# EAGLE design AD7173 (EAGLE 7.5.0)
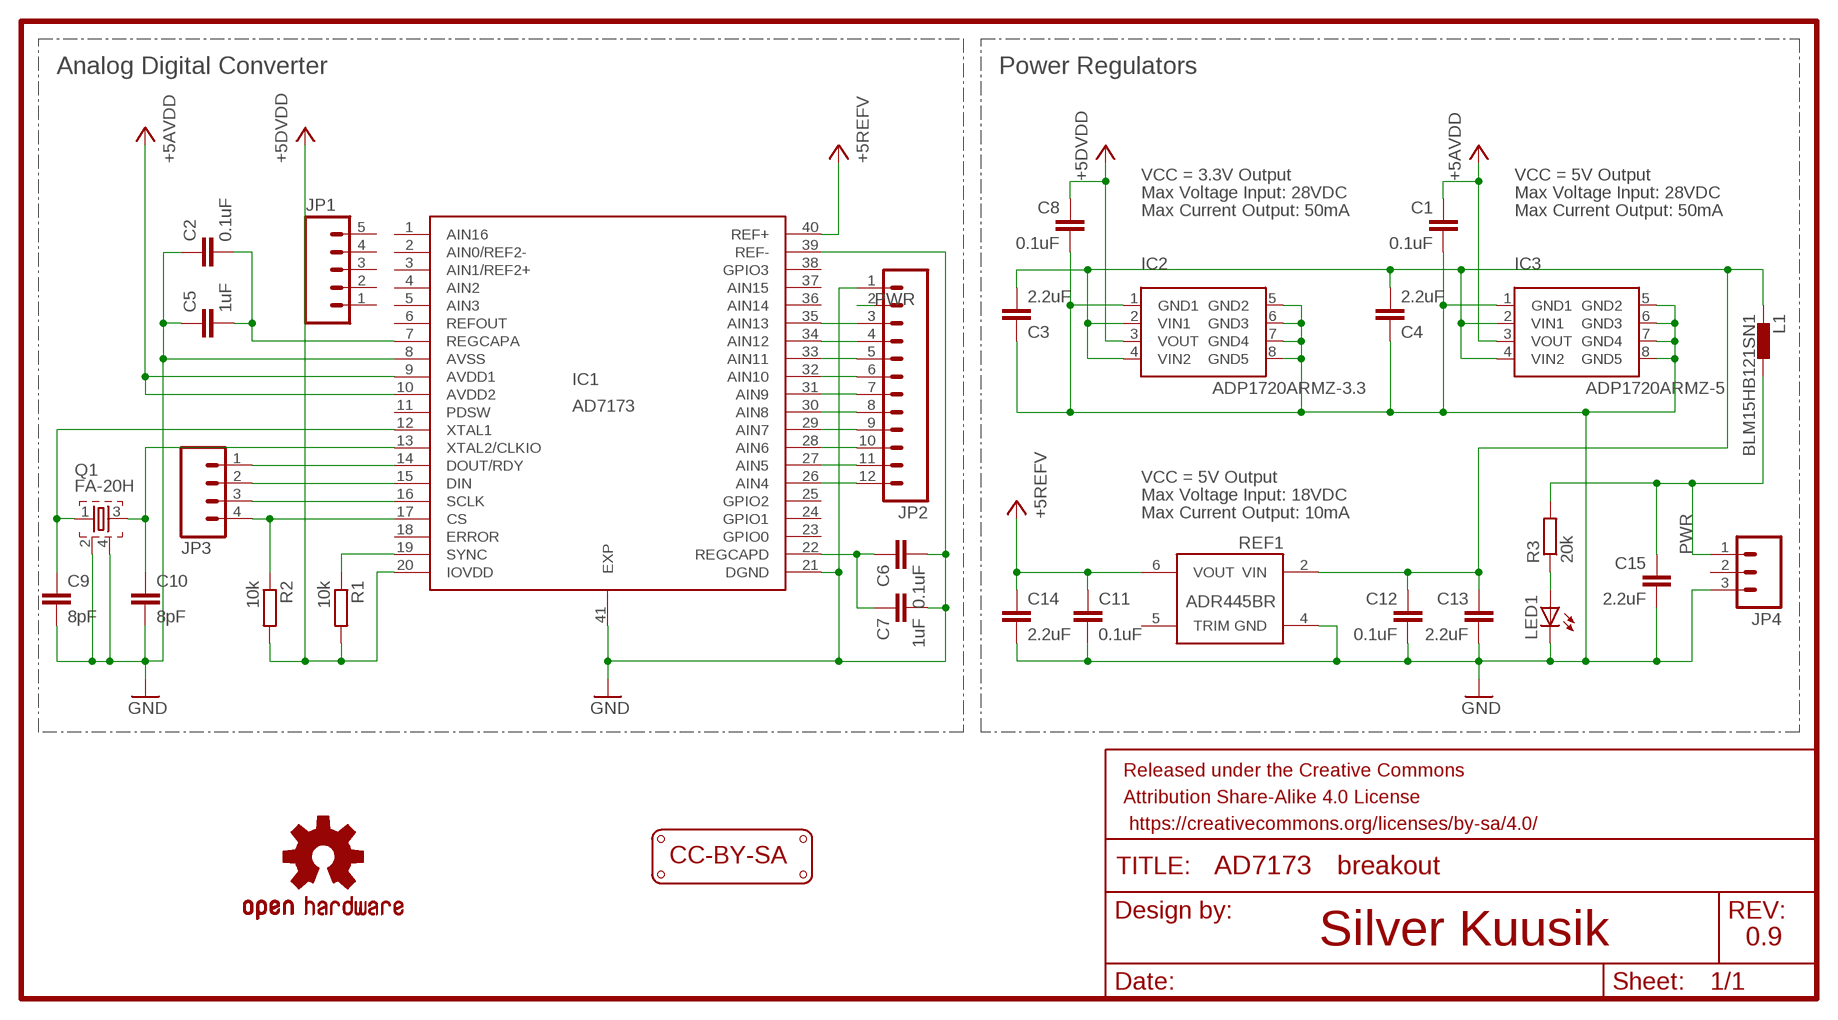
[diagram p0: schematic, sheet 1]

## Parts
C1  0.1uF  C-EUC0402  [C0402]
C2  0.1uF  C-EUC0402  [C0402]
C3  2.2uF  C-EUC0402  [C0402]
C4  2.2uF  C-EUC0402  [C0402]
C5  1uF  C-EUC0402  [C0402]
C6  0.1uF  C-EUC0402  [C0402]
C7  1uF  C-EUC0402  [C0402]
C8  0.1uF  C-EUC0402  [C0402]
C9  8pF  C-EUC0402  [C0402]
C10  8pF  C-EUC0402  [C0402]
C11  0.1uF  C-EUC0402  [C0402]
C12  0.1uF  C-EUC0402  [C0402]
C13  2.2uF  C-EUC0402  [C0402]
C14  2.2uF  C-EUC0402  [C0402]
C15  2.2uF  C-EUC0402  [C0402]
FRAME1  FRAME-LETTER  [CREATIVE_COMMONS]
IC1  AD7173  [LFCSP_WQ6X6MM]
IC2  ADP1720ARMZ-3.3  POWER  [MSOP08]
IC3  ADP1720ARMZ-5  POWER  [MSOP08]
JP1  M05PTH  [1X05]
JP2  M12PTH  [1X12]
JP3  M04PTH  [1X04]
JP4  M03PTH  [1X03]
L1  BLM15HB121SN1  [0402]
LED1  LEDCHIP-LED0603  [CHIP-LED0603]
LOGO1  OSHW-LOGOS  [OSHW-LOGO-S]
LOGO2  LOGO_CC-BY-SA  [LOGO_CC-BY-SA]
Q1  FA-20H  [FA-20H]
R1  10k  R-EU_R0402  [R0402]
R2  10k  R-EU_R0402  [R0402]
R3  20k  R-EU_R0402  [R0402]
REF1  ADR445BR  [SO8]

## Nets
+3V3: C8.1 IC1.20(IOVDD) IC2.3(VOUT) R1.2 R2.2 ; supply symbol labelled +5DVDD
+5V: C1.1 IC1.9(AVDD1) IC1.10(AVDD2) IC3.3(VOUT) ; supply symbol labelled +5AVDD
GND: C1.2 C2.1 C3.1 C4.1 C5.1 C6.2 C7.2 C8.2 C9.2 C10.2 C11.2 C12.2 C13.2 C14.2 C15.2 IC1.8(AVSS) IC1.21(DGND) IC1.39(REF-) IC1.41(EXP) IC2.1(GND1) IC2.5(GND2) IC2.6(GND3) IC2.7(GND4) IC2.8(GND5) IC3.1(GND1) IC3.5(GND2) IC3.6(GND3) IC3.7(GND4) IC3.8(GND5) JP2.1 JP4.3 LED1.C Q1.2 Q1.4 REF1.4(GND)
N$1: IC1.16(SCLK) JP3.3
N$3: IC1.17(CS) JP3.4 R2.1
N$4: C6.1 C7.1 IC1.22(REGCAPD)
N$5: IC1.34(AIN12) JP2.4
N$6: C2.2 C5.2 IC1.7(REGCAPA)
N$7: IC1.35(AIN13) JP2.3
N$10: IC1.33(AIN11) JP2.5
N$11: IC1.32(AIN10) JP2.6
N$12: IC1.31(AIN9) JP2.7
N$13: IC1.30(AIN8) JP2.8
N$14: IC1.29(AIN7) JP2.9
N$15: IC1.15(DIN) JP3.2
N$16: IC1.27(AIN5) JP2.11
N$17: IC1.26(AIN4) JP2.12
N$22: C10.1 IC1.13(XTAL2/CLKIO) Q1.3
N$23: IC1.28(AIN6) JP2.10
N$24: IC1.14(DOUT/RDY) JP3.1
N$27: C9.1 IC1.12(XTAL1) Q1.1
N$31: LED1.A R3.1
N$39: IC1.19(SYNC) R1.1
PWR: C15.1 JP2.2 JP4.1 L1.2 R3.2
VCC: C11.1 C14.1 IC1.40(REF+) REF1.6(VOUT) ; supply symbol labelled +5REFV
VIN: C3.2 C4.2 C12.1 C13.1 IC2.2(VIN1) IC2.4(VIN2) IC3.2(VIN1) IC3.4(VIN2) L1.1 REF1.2(VIN)
Unconnected: IC1.1(AIN16) IC1.2(AIN0/REF2-) IC1.3(AIN1/REF2+) IC1.4(AIN2) IC1.5(AIN3) IC1.6(REFOUT) IC1.11(PDSW) IC1.18(ERROR) IC1.23(GPIO0) IC1.24(GPIO1) IC1.25(GPIO2) IC1.36(AIN14) IC1.37(AIN15) IC1.38(GPIO3) JP1.1 JP1.2 JP1.3 JP1.4 JP1.5 JP4.2 REF1.5(TRIM)

## Notes on the sheet
- Analog Digital Converter | Power Regulators
- VCC = 3.3V Output | VCC = 5V Output
- Max Voltage Input: 28VDC | Max Voltage Input: 28VDC
- Max Current Output: 50mA | Max Current Output: 50mA
- VCC = 5V Output
- Max Voltage Input: 18VDC
- Max Current Output: 10mA
- breakout
- Silver Kuusik | 0.9

## Library data of the parts
C1-C15 = rcl:C-EU: CAPACITOR, European symbol
FRAME1 = SparkFun-Aesthetics:FRAME-LETTER: Schematic Frame Standard 8.5x11 US Letter frame
IC1 = AD7173:AD7173: IEEE 802.15.4? 2.4 GHz RF Transceiver Source: http://ww1.microchip.com/downloads/en/DeviceDoc/39776a.pdf; MPN: MRF24J40-I/ML; OC_FARNELL: 1436019; OC_NEWARK: 17M0699
IC2 IC3 = AD7173:POWER
JP1 = SparkFun-Connectors:M05: Header 5 Standard 5-pin 0.1" header. Use with straight break away headers (SKU : PRT-00116), right angle break away headers (PRT-00553), swiss pins (PRT-00743), machine pins (PRT-00117), and female headers (PRT-00115). Molex polarized connector foot print use with SKU : PRT-08230 with associated crimp pins and housings.
JP2 = SparkFun-Connectors:M12: Header 12 Standard 12-pin 0.1" header. Use with straight break away headers (SKU : PRT-00116), right angle break away headers (PRT-00553), swiss pins (PRT-00743), machine pins (PRT-00117), and female headers (PRT-00115).
JP3 = SparkFun-Connectors:M04: Header 4 Standard 4-pin 0.1" header. Use with straight break away headers (SKU : PRT-00116), right angle break away headers (PRT-00553), swiss pins (PRT-00743), machine pins (PRT-00117), and female headers (PRT-00115). Molex polarized connector foot print use with SKU : PRT-08231 with associated crimp pins and housings. 1MM SMD Version SKU: PRT-10208
JP4 = SparkFun-Connectors:M03: Header 3 Standard 3-pin 0.1" header. Use with straight break away headers (SKU : PRT-00116), right angle break away headers (PRT-00553), swiss pins (PRT-00743), machine pins (PRT-00117), and female headers (PRT-00115). Molex polarized connector foot print use with SKU : PRT-08232 with associated crimp pins and housings.
L1 = inductors:BLM15H: EMIFIL (R) Chip Ferrite Bead for GHz Noise Source: http://www.murata.com/ Ferrite Bead BLM15H.pdf
LED1 = led:LED: LED OSRAM: - CHIPLED LG R971, LG N971, LY N971, LG Q971, LY Q971, LO R971, LY R971 LH N974, LH R974 LS Q976, LO Q976, LY Q976 LO Q996 - Hyper CHIPLED LW Q18S LB Q993, LB Q99A, LB R99A - SideLED LS A670, LO A670, LY A670, LG A670, LP A670 LB A673, LV A673, LT A673, LW A673 LH A674 LY A675 LS A676, LA A676, LO A676, LY A676, LW A676 LS A679, LY A679, LG A679 - Hyper Micro SIDELED® LS Y876, LA Y876, LO Y876, LY Y876 LT Y87S - SmartLED LW L88C, LW L88S LB L89C, LB L89S, LG L890 LS L89K, LO L89K, LY L89K LS L896, LA L896, LO L896, LY L896 - TOPLED LS T670, LO T670, LY T670, LG T670, LP T670 LSG T670, LSP T670, LSY T670, LOP T670, LYG T670 LG T671, LOG T671, LSG T671 LB T673, LV T673, LT T673, LW T673 LH T674 LS T676, LA T676, LO T676, LY T676, LB T676, LH T676, LSB T676, LW T676 LB T67C, LV T67C, LT T67C, LS T67K, LO T67K, LY T67K, LW E67C LS E67B, LA E67B, LO E67B, LY E67B, LB E67C, LV E67C, LT E67C LW T67C LS T679, LY T679, LG T679 LS T770, LO T770, LY T770, LG T770, LP T770 LB T773, LV T773, LT T773, LW T773 LH T774 LS E675, LA E675, LY E675, LS T675 LS T776, LA T776, LO T776, LY T776, LB T776 LHGB T686 LT T68C, LB T68C - Hyper Mini TOPLED® LB M676 - Mini TOPLED Santana® LG M470 LS M47K, LO M47K, LY M47K Source: http://www.osram.convergy.de LUXEON: - LUMILED® LXK2-PW12-R00, LXK2-PW12-S00, LXK2-PW14-U00, LXK2-PW14-V00 LXK2-PM12-R00, LXK2-PM12-S00, LXK2-PM14-U00 LXK2-PE12-Q00, LXK2-PE12-R00, LXK2-PE12-S00, LXK2-PE14-T00, LXK2-PE14-U00 LXK2-PB12-K00, LXK2-PB12-L00, LXK2-PB12-M00, LXK2-PB14-N00, LXK2-PB14-P00, LXK2-PB14-Q00 LXK2-PR12-L00, LXK2-PR12-M00, LXK2-PR14-Q00, LXK2-PR14-R00 LXK2-PD12-Q00, LXK2-PD12-R00, LXK2-PD12-S00 LXK2-PH12-R00, LXK2-PH12-S00 LXK2-PL12-P00, LXK2-PL12-Q00, LXK2-PL12-R00 Source: www.luxeon.com KINGBRIGHT: KA-3528ASYC Source: www.kingbright.com
LOGO1 = SparkFun-Aesthetics:OSHW-LOGO: Open Source Hardware Logo This logo indicates the piece of hardware it is found on incorporates a OSHW license and/or adheres to the definition of open source hardware found here: http://freedomdefined.org/OSHW
LOGO2 = dp_devices:LOGO_CC-BY-SA
Q1 = crystal:FA-: MHz RANGE CRYSTAL UNIT Source: Epson Toyocom
R1-R3 = rcl:R-EU_: RESISTOR, European symbol
REF1 = kblom:ADR44: Ultralow Noise, LDO XFET Voltage References with Current Sink and Source Applications: Precision data acquisition systems High resolution data converters Battery-powered instrumentation Portable medical instruments Industrial process control systems Precision instruments Optical control circuits source <http://www.analog.com/static/imported-files/data_sheets/ADR440_441_443_444_445.pdf> vref

## Net classes
0 default: clearance 0.205 mm

## Board
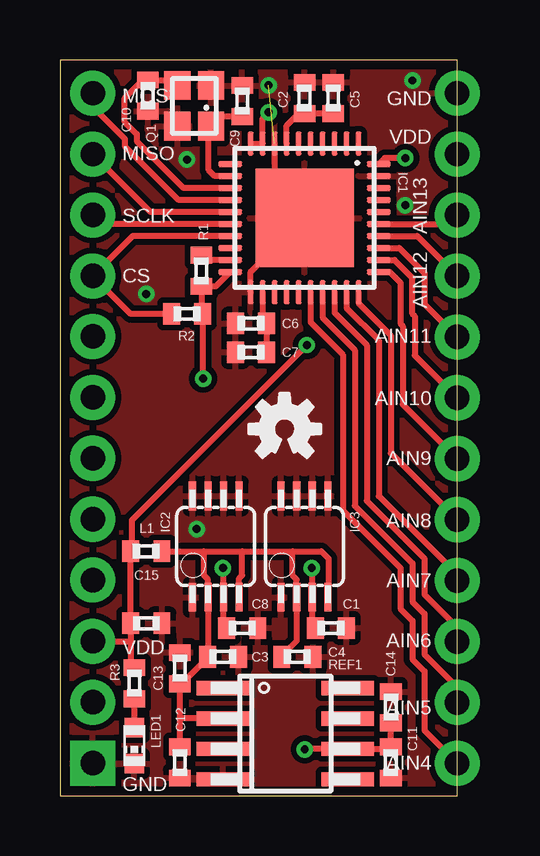
[diagram p1: board, top side]
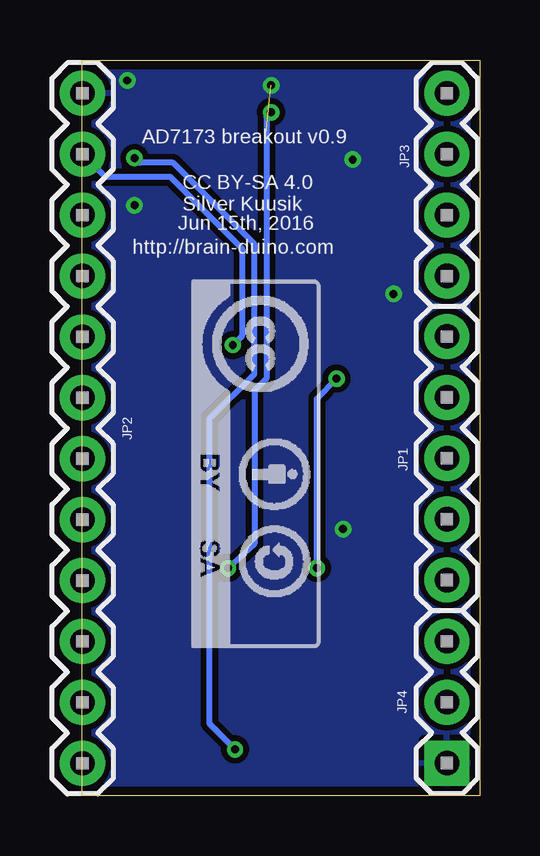
[diagram p2: board, bottom side, seen from below]

Size 16.57 x 30.68 mm. Coordinates in mm from the lower left corner, seen from the top.
Outline: 0,0 16.57,0.01 16.57,30.68 0,30.67 0,0
Copper layers (1*16): Top 0.0356mm / dielectric 1.5011mm / Bottom 0.0356mm
Design rules "LaenPCBOrder": minimum track width 6mil, minimum drill 13mil, track to track 6mil, track to pad 6mil, pad to pad 6mil, via to via 6mil, smd to smd 6mil, copper to edge 15mil, drill to drill 6mil, minimum pad ring 7mil, minimum via ring 7mil, stop-mask expansion 3mil, vias tented up to drill 0mil, thermal gap 10mil

### Footprints (pad centres in the part's own frame; a part is rotated, then mirrored left to right if it is on the bottom)
C0402 = smd 0.7 x 0.9: 1 -0.65,0; 2 0.65,0
LFCSP_WQ6X6MM = smd 1 x 0.25: 1 -3.1,2.25; 2 -3.1,1.75; 3 -3.1,1.25; 4 -3.1,0.75; 5 -3.1,0.25; 6 -3.1,-0.25; 7 -3.1,-0.75; 8 -3.1,-1.25; 9 -3.1,-1.75; 10 -3.1,-2.25; 21 3.1,-2.25; 22 3.1,-1.75; 23 3.1,-1.25; 24 3.1,-0.75; 25 3.1,-0.25; 26 3.1,0.25; 27 3.1,0.75; 28 3.1,1.25; 29 3.1,1.75; 30 3.1,2.25 | smd 0.25 x 1: 11 -2.25,-3.1; 12 -1.75,-3.1; 13 -1.25,-3.1; 14 -0.75,-3.1; 15 -0.25,-3.1; 16 0.25,-3.1; 17 0.75,-3.1; 18 1.25,-3.1; 19 1.75,-3.1; 20 2.25,-3.1; 31 2.25,3.1; 32 1.75,3.1; 33 1.25,3.1; 34 0.75,3.1; 35 0.25,3.1; 36 -0.25,3.1; 37 -0.75,3.1; 38 -1.25,3.1; 39 -1.75,3.1; 40 -2.25,3.1 | smd 4.1 x 4.1: 41 0,0
MSOP08 = smd 0.3 x 1.2: 1 -0.976,-2.113; 2 -0.326,-2.113; 3 0.324,-2.113; 4 0.974,-2.113; 5 0.974,2.112; 6 0.324,2.112; 7 -0.326,2.112; 8 -0.976,2.112
1X05 = drill 1.016 pad 1.88: 1 0,0; 2 2.54,0; 3 5.08,0; 4 7.62,0; 5 10.16,0
1X12 = drill 1.016 pad 1.88: 1 0,0; 2 2.54,0; 3 5.08,0; 4 7.62,0; 5 10.16,0; 6 12.7,0; 7 15.24,0; 8 17.78,0; 9 20.32,0; 10 22.86,0; 11 25.4,0; 12 27.94,0
1X04 = drill 1.016 pad 1.88: 1 0,0; 2 2.54,0; 3 5.08,0; 4 7.62,0
1X03 = drill 1.016 pad 1.88: 1 0,0; 2 2.54,0 | drill 1.016 pad 1.88 square: 3 5.08,0
0402 = smd 0.7 x 0.9: 1 -0.65,0; 2 0.65,0
CHIP-LED0603 = smd 0.8 x 0.8: A 0,-0.75; C 0,0.75
FA-20H = smd 1.2 x 1.1: 1 -0.85,-0.7; 2 0.85,-0.7; 3 0.85,0.7; 4 -0.85,0.7
R0402 = smd 0.7 x 0.9: 1 -0.65,0; 2 0.65,0
SO8 = smd 0.6 x 2.2: 1 -1.905,-2.6; 2 -0.635,-2.6; 3 0.635,-2.6; 4 1.905,-2.6; 5 1.905,2.6; 6 0.635,2.6; 7 -0.635,2.6; 8 -1.905,2.6

### Placement (x,y rotation side)
C1  11.3,7 0 top
C2  10.2,29.1 270 top
C3  6.8,5.8 180 top
C4  9.9,5.8 180 top
C5  11.4,29.1 270 top
C6  7.97,19.7 180 top
C7  7.97,18.5 180 top
C8  7.6,7 0 top
C9  7.6,28.97 90 top
C10  3.67,29.2 270 top
C11  13.8,1.4 270 top
C12  5,1.4 270 top
C13  5,5.33 90 top
C14  13.8,3.7 90 top
C15  3.6,7.2 0 top
FRAME1  -21.7,-8 0 top  (outside the outline)
IC1  10.2,24.1 270 top
IC2  6.5,10.4 0 top
IC3  10.2,10.4 0 top
JP1  1.37,9 90 bottom
JP2  16.57,29.3 270 bottom
JP3  1.37,29.3 270 bottom
JP4  1.37,6.45 270 bottom
L1  3.6,10.2 180 top
LED1  3.1,2.1 180 top
LOGO1  9.37,15.3 0 top
LOGO2  12,21.5 270 bottom
Q1  5.6,28.77 90 top
R1  5.9,21.9 270 top
R2  5.3,20.1 0 top
R3  3.1,4.7 90 top
REF1  9.4,2.6 270 top

### Tracks (layer width: path | path; a pad name or v marks a point on that pad's centre or on a via)
+3V3  (via drill 0.33)
  Top 0.254: IC1.20 6.5,21.25 R1.2 5.9,20.15 R2.2 5.97,20.08 v5.97,17.4 | IC2.3 6.82,7.88 | IC2.3 6.82,9.38 v6.8,9.5 | C8.1 6.82,6.9 IC2.3
  Bottom 0.254: v6.8,9.5 6.8,16.57 v5.97,17.4
+5V  (via drill 0.33)
  Top 0.254: IC1.10 IC1.9 8.45,28.25 v8.7,28.5 | v10.5,9.5 10.52,9.48 IC3.3 10.52,6.9 C1.1
  Bottom 0.254: v8.7,28.5 8.9,28.3 8.9,17.4 9.4,16.9 9.4,10.5 v10.5,9.5
GND  (via drill 0.33)  (1 unrouted)
  Top 0.254: IC1.8 8.95,25.35 IC1.41 7.95,21.85 IC1.21
  other vias: 5.3,26.53 8.7,29.63 3.6,20.93 14.7,29.83 14.4,24.63 5.7,11.13
  pour Top (isolate 0.24): -0.11,30.85 16.64,30.85 16.52,-0.18 -0.22,-0.18
  pour Bottom (isolate 0.24): -0.12,30.78 16.62,30.82 16.62,-0.14 -0.12,-0.18
N$1
  Top 0.254: IC1.16 1.74,23.85 JP3.3
N$3
  Top 0.254: IC1.17 3.04,23.35 JP3.4 2.95,20.1 R2.1
N$4
  Top 0.254: IC1.22 8.45,19.87 C6.1 C7.1
N$5
  Top 0.254: IC1.34 14.9,23.35 JP2.4
N$6
  Top 0.254: C5.2 C2.2 9.95,28.45 9.45,27.95 IC1.7
N$7
  Top 0.254: IC1.35 16.2,23.85 JP2.3
N$10
  Top 0.254: IC1.33 14.15,22.85 15.2,21.8 15.2,20.51 JP2.5
N$11
  Top 0.254: IC1.32 13.95,22.35 14.7,21.6 14.7,20.1 14.8,20 14.8,18.37 JP2.6
N$12
  Top 0.254: JP2.7 14.3,16.33 14.3,19.6 14.2,19.7 14.2,21.4 13.75,21.85 IC1.31
N$13
  Top 0.254: IC1.30 12.45,20.55 13.8,19.2 13.8,14.29 JP2.8
N$14
  Top 0.254: IC1.29 11.95,20.35 13.3,19 13.3,12.5 16.57,9.23 JP2.9
N$15
  Top 0.254: IC1.15 3.78,24.35 JP3.2
N$16
  Top 0.254: IC1.27 10.95,19.95 12.3,18.6 12.3,12.1 14.7,9.7 14.7,8.1 15.2,7.6 15.2,5.9 16.57,4.53 JP2.11
N$17
  Top 0.254: IC1.26 10.45,19.75 11.8,18.4 11.8,11.9 14.2,9.5 14.2,7.8 14.7,7.3 14.7,5.7 15.2,5.2 15.2,2.73 JP2.12
N$22
  Top 0.254: IC1.13 5.15,25.35 3.2,27.3 3.2,27.6 2.7,28.1 2.7,29.1 3.45,29.85 C10.1 4.67,29.85 Q1.3
N$23
  Top 0.254: IC1.28 11.45,20.15 12.8,18.8 12.8,12.3 15.2,9.9 15.2,8.4 16.57,7.03 JP2.10
N$24
  Top 0.254: JP3.1 1.37,28.73 2.7,27.4 2.7,27.1 4.95,24.85 IC1.14
N$27
  Top 0.254: IC1.12 6.45,25.85 6.2,26.1 6.2,27.82 Q1.1 6.3,28.32 C9.1
N$31
  Top 0.254: R3.1 LED1.A
N$39
  Top 0.254: IC1.19 6.1,22.35 R1.1
PWR  (via drill 0.33)
  Top 0.254: 2.95,6.4 C15.1 L1.2 3,10.25 3,11.5 v10.3,18.8 | 2.95,6.4 2.95,5.5 R3.2 | JP4.1 2.9,6.45 2.95,6.4
  Bottom 0.254: v10.3,18.8 9.9,19.2 9.9,22.8 12.9,25.8 15.61,25.8 JP2.2
VCC  (via drill 0.33)
  Top 0.254: v14.4,26.6 13.55,26.6 IC1.40 | C14.1 C11.1 13.71,1.97 REF1.6 10.23,1.97 v10.21,1.94
  Bottom 0.254: v10.21,1.94 11.27,3 11.27,15.73 9.4,17.6 9.4,23 12.8,26.4 14.2,26.4 v14.4,26.6
VIN
  Top 0.254: L1.1 6,10.2 | 6,10.2 7.6,10.2 | 7.6,10.2 9.7,10.2 | 9.7,10.2 10.9,10.2 11.2,9.9 11.2,8.31 IC3.4 | 9.7,10.2 9.7,9.2 9.87,9.03 IC3.2 9.87,6.47 9.25,5.85 C4.2 | C3.2 6.17,5.88 IC2.2 6.17,9.03 6,9.2 6,10.2 | C12.1 5,3.2 | 5,3.2 C13.1 5.08,4.68 6.15,5.75 C3.2 | IC2.4 7.47,9.07 7.6,9.2 7.6,10.2 | C3.2 6.15,5.73 | REF1.2 5.04,3.23 5,3.2

### Text on the board
tNames: MOSI | GND | VDD | MISO | AIN13 | SCLK | AIN12 | CS | AIN11 | AIN10 | AIN9 | AIN8 | AIN7 | AIN6 | VDD | AIN5 | AIN4 | GND
bNames: AD7173 breakout v0.9 | CC BY-SA 4.0 | Silver Kuusik | Jun 15th, 2016 | http://brain-duino.com
tDocu: Silver Kuusik